# Altium schematic sheet MCU_Control.SchDoc
size A4; SheetNumber: 2; SheetTotal: 7
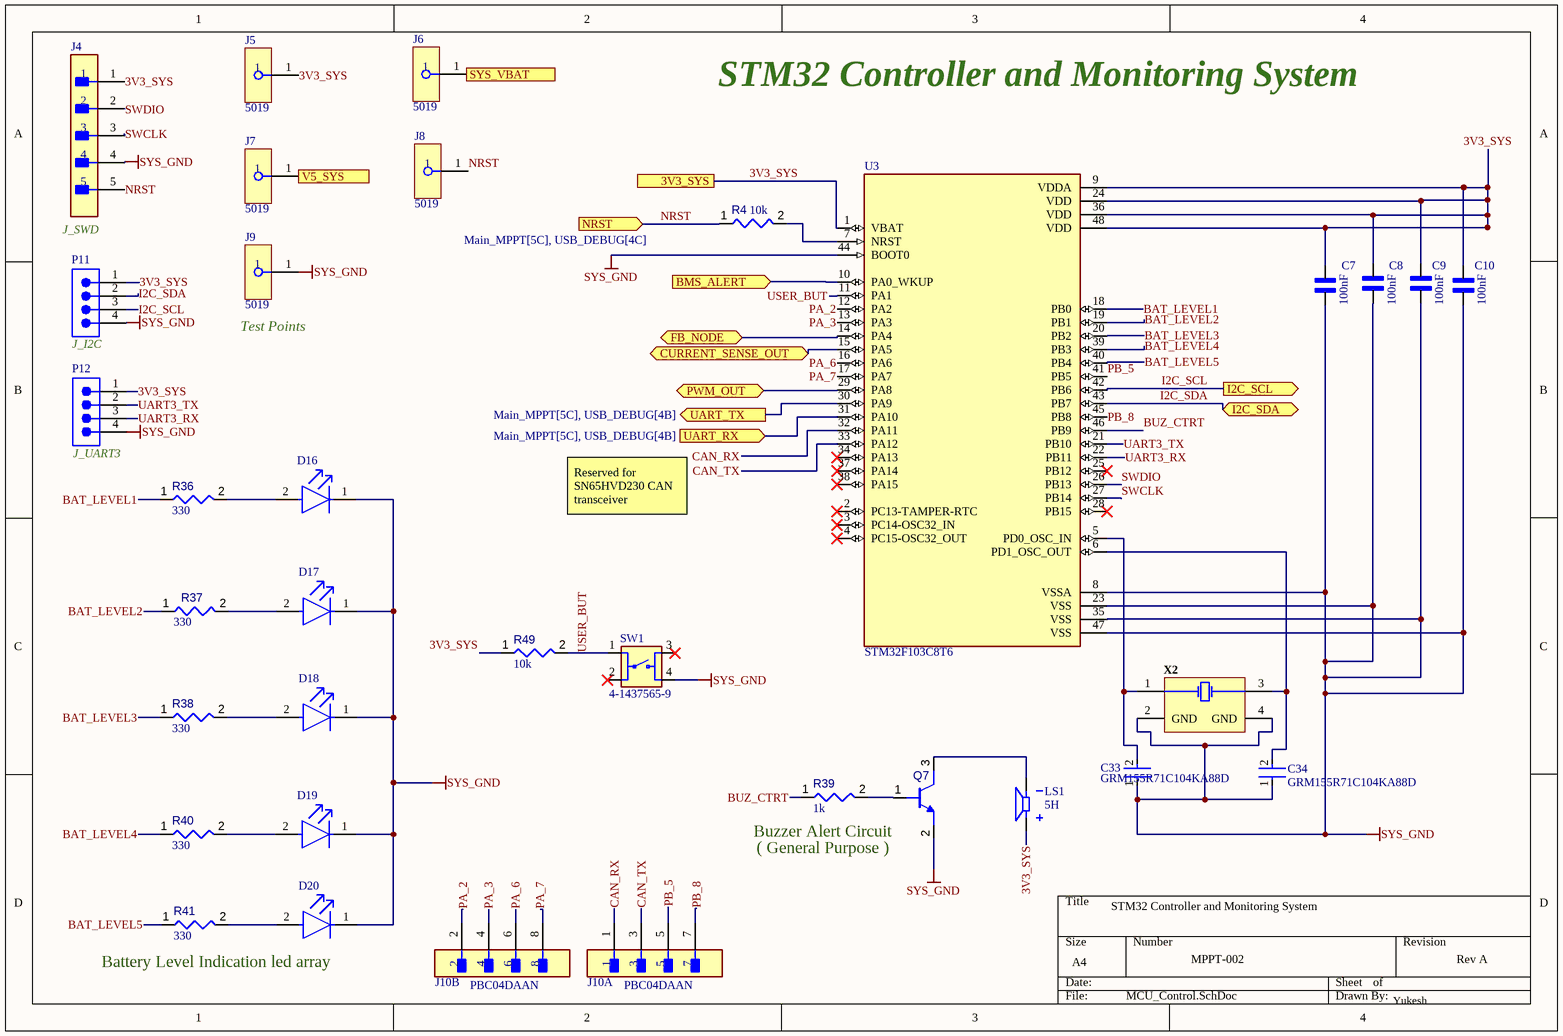
[diagram p0: MCU_Control.SchDoc]

## Parts
C7  value 100nF  [CAPC1608X90N]  (hidden comment: 0603YC104KAZ2A)
C8  value 100nF  [CAPC1608X90N]  (hidden comment: 0603YC104KAZ2A)
C9  value 100nF  [CAPC1608X90N]  (hidden comment: 0603YC104KAZ2A)
C10  value 100nF  [CAPC1608X90N]  (hidden comment: 0603YC104KAZ2A)
C33  GRM155R71C104KA88D  [FP-GRM15-MFG]
C34  GRM155R71C104KA88D  [FP-GRM15-MFG]
D16  SML-LX0805UWC-TR  [FP-SML-LX0805UWC-TR-MFG]  (value not drawn)
D17  SML-LX0805UWC-TR  [FP-SML-LX0805UWC-TR-MFG]  (value not drawn)
D18  SML-LX0805UWC-TR  [FP-SML-LX0805UWC-TR-MFG]  (value not drawn)
D19  SML-LX0805UWC-TR  [FP-SML-LX0805UWC-TR-MFG]  (value not drawn)
D20  SML-LX0805UWC-TR  [FP-SML-LX0805UWC-TR-MFG]  (value not drawn)
J4  22-28-4050  [FP-22-28-4050-MFG]  (value not drawn)
J5  5019  [5019_MFG]
J6  5019  [5019_MFG]
J7  5019  [5019_MFG]
J8  5019  [5019_MFG]
J9  5019  [5019_MFG]
J10  PBC04DAAN  [FP-PBC04DAAN-MFG]  (parts A,B of 2)
LS1  value 5H  [XDCR_CMI-1210-5-95T]  (hidden comment: CMI-1210-5-95T)
P11  TSW-104-08-G-S  [SMTC-TSW-104-08-X-S]  (value not drawn)
P12  TSW-104-08-G-S  [SMTC-TSW-104-08-X-S]  (value not drawn)
Q7  MMBT2222AM3T5G  [ROHM-SOT723-3_V]  (value not drawn)
R4  value 10k  [RESC3216X60X45ML15T20]  (hidden comment: Resistor 10k +/-1% 1206 250 mW)
R36  value 330  [RESC0402(1005)_L]  (hidden comment: 330R2J)
R37  value 330  [RESC0402(1005)_L]  (hidden comment: 330R2J)
R38  value 330  [RESC0402(1005)_L]  (hidden comment: 330R2J)
R39  value 1k  [RESC0805(2012)_L]  (hidden comment: 1KR5J)
R40  value 330  [RESC0402(1005)_L]  (hidden comment: 330R2J)
R41  value 330  [RESC0402(1005)_L]  (hidden comment: 330R2J)
R49  value 10k  [RESC0402(1005)_L]  (hidden comment: 10KR2F)
SW1  4-1437565-9  [TE_4-1437565-9]
U3  STM32F103C8T6  [QFP50P900X900X160-48N]
X2  TSX-3225 24.0000MF15X-AC3  [EPSON-TSX-3225_V]  (value not drawn)

## Ports
3V3_SYS (see Main_MPPT[5B], BMS_CORE[2C], OUTPUT_CONNECTORS[4B], POWER_DISTRIBUTION[4C], POWER_SWITCH[2C], POWER_SWITCH[2D], USB_DEBUG[4B]), BMS_ALERT (in, see Main_MPPT[4C], BMS_CORE[2B]), CURRENT_SENSE_OUT (bidir, see Main_MPPT[4C]), FB_NODE (bidir, see Main_MPPT[4B]), I2C_SCL (out, see Main_MPPT[4C], BMS_CORE[4B]), I2C_SDA (bidir, see Main_MPPT[4C], BMS_CORE[4B]), NRST (in, see Main_MPPT[5C], USB_DEBUG[4C]), PWM_OUT (bidir, see Main_MPPT[4B]), SYS_VBAT (in, see Main_MPPT[5B], POWER_DISTRIBUTION[1A], POWER_SWITCH[1B]), UART_RX (in, see Main_MPPT[5C], USB_DEBUG[4B]), UART_TX (out, see Main_MPPT[5C], USB_DEBUG[4B]), V5_SYS (see Main_MPPT[5C], OUTPUT_CONNECTORS[4C], POWER_DISTRIBUTION[4B])

## Nets
SYS_GND: C7.1 C8.1 C9.1 C10.1 C33.1 C34.1 D16.1(C) D17.1(C) D18.1(C) D19.1(C) D20.1(C) J4.4 J9.1 P11.4 P12.4 Q7.2(E) SW1.4 U3.8(VSSA) U3.23(VSS) U3.35(VSS) U3.44(BOOT0) U3.47(VSS) X2.2(GND) X2.4(GND)
3V3_SYS: C7.2 C8.2 C9.2 C10.2 J4.1 J5.1 LS1.P P11.1 P12.1 R49.1 U3.1(VBAT) U3.9(VDDA) U3.24(VDD) U3.36(VDD) U3.48(VDD) ; port 3V3_SYS
BAT_LEVEL1: R36.1 U3.18(PB0)
BAT_LEVEL2: R37.1 U3.19(PB1)
BAT_LEVEL3: R38.1 U3.20(PB2)
BAT_LEVEL4: R40.1 U3.39(PB3)
BAT_LEVEL5: R41.1 U3.40(PB4)
BMS_ALERT: U3.10(PA0_WKUP) ; port BMS_ALERT
BUZ_CTRT: R39.1 U3.46(PB9)
CAN_RX: J10.1 U3.32(PA11)
CAN_TX: J10.3 U3.33(PA12)
CURRENT_SENSE_OUT: U3.15(PA5) ; port CURRENT_SENSE_OUT
FB_NODE: U3.14(PA4) ; port FB_NODE
I2C_SCL: P11.3 U3.42(PB6) ; port I2C_SCL
I2C_SDA: P11.2 U3.43(PB7) ; port I2C_SDA
NRST: J4.5 J8.1 R4.1 ; port NRST
PA_2: J10.2 U3.12(PA2)
PA_3: J10.4 U3.13(PA3)
PA_6: J10.6 U3.16(PA6)
PA_7: J10.8 U3.17(PA7)
PB_5: J10.5 U3.41(PB5)
PB_8: J10.7 U3.45(PB8)
PWM_OUT: U3.29(PA8) ; port PWM_OUT
SWCLK: J4.3 U3.27(PB14)
SWDIO: J4.2 U3.26(PB13)
SYS_VBAT: J6.1 ; port SYS_VBAT
UART3_RX: P12.3 U3.22(PB11)
UART3_TX: P12.2 U3.21(PB10)
UART_RX: U3.31(PA10) ; port UART_RX
UART_TX: U3.30(PA9) ; port UART_TX
USER_BUT: R49.2 SW1.1 U3.11(PA1)
V5_SYS: J7.1 ; port V5_SYS
NetC33_2: C33.2 U3.5(PD0_OSC_IN) X2.1(X1)
NetC34_2: C34.2 U3.6(PD1_OSC_OUT) X2.3(X2)
NetD16_2: D16.2(A) R36.2
NetD17_2: D17.2(A) R37.2
NetD18_2: D18.2(A) R38.2
NetD19_2: D19.2(A) R40.2
NetD20_2: D20.2(A) R41.2
NetLS1_N: LS1.N Q7.3(C)
NetQ7_1: Q7.1(B) R39.2
NetR4_2: R4.2 U3.7(NRST)

Not connected (* = marked no-connect by the designer): SW1 2* 3*; U3 2(PC13-TAMPER-RTC)* 3(PC14-OSC32_IN)* 4(PC15-OSC32_OUT)* 25(PB12)* 28(PB15)* 34(PA13)* 37(PA14)* 38(PA15)*

## Notes on the sheet
- STM32 Controller and Monitoring System
- J_SWD
- (near P11) J_I2C
- (near J9) Test Points
- (near P12) J_UART3
- Reserved for SN65HVD230 CAN transceiver
- (near Q7) Buzzer Alert Circuit
- (near Q7) ( General Purpose )
- Battery Level Indication led array
- MPPT-002
- Rev A
- Yukesh

## Library data of the parts
C7-C10 = CMP-001-00089-1: Capacitor MLCC 0603 100nF 16V; MF: AVX; MP: 0603YC104KAZ2A; SnapEDA_Link: https://www.snapeda.com/parts/0603YC104KAZ2A/AVX/view-part/?ref=snap; Case/Package: 1608 AVX; Source: 0603YC104KAZ2A.SchLib; Check_prices: https://www.snapeda.com/parts/0603YC104KAZ2A/AVX/view-part/?ref=eda; Pins: 2; Design Item ID: 0603YC104KAZ2A; Component Type: Standard
C33 C34 = CMP-2100-03641-2: CAP CER 0.1UF 16V X7R 0402; Manufacturer: Murata; Standoff Height: 0mm; Tolerance: 10%; Voltage Rating: 16Vdc; Material: Ceramic; Capacitance: 0.10μF; Value: 0.10μF; RoHS: TRUE; Manufacturer Part Number: GRM155R71C104KA88D; Temperature Characteristic: X7R; Octopart: https://octopart.com/grm155r71c104ka88d-murata-196880; Digikey Description: CAP CER 0.1UF 16V X7R 0402; Device Class L3: Ceramic Capacitors; Height: 0.55mm; ComponentLink2Description: Datasheet; Temperature Range Low: -55°C; Ipc Land Pattern Name: CAPC10050X219; ComponentLink2URL: https://search.murata.co.jp/Ceramy/image/img/A01X/G101/ENG/GRM155R71H471KA01-01A.pdf; Device Class L1: Passive Components; Lead Free: yes; Category: Cap; Package: GRM15; Temperature: -55°C to +125°C; Device Class L2: Capacitors; Temperature Range High: +125°C; Mouser Description: 0402 0.1 uF 16V ±10 % Tolerance X7R SMT Multilayer Ceramic Capacitor
D16-D20 = CMP-00229-00139794-1: SML-LX0805UWC-TR White LED, 0805 Diffused, Rectangle Lens SMD package; NexarPartId: 139794; Approvals: CSA, UL; Lens Color: Clear, Yellow; Luminous Intensity: 150mcd; Power Rating: 120mW; Forward Current: 20mA; Forward Voltage: 3.5V; Number of LEDs: 1; Viewing Angle: 120°; RoHS: Compliant; Case/Package: 0805; Illumination Color: White; Min Operating Temperature: -40°C; Mount: Surface Mount; Max Operating Temperature: 85°C
J4 = CMP-00257-00278173-1: 22-28-4050 KK® 254 Breakaway Header, Vertical, 5 Circuits, Tin (Sn) Plating, Mating Pin Length 6.09mm; NexarPartId: 278173; Voltage Rating: 250V; Number of Contacts: 5; Contact Resistance: 20mΩ; Gender: Male; Pitch: 2.54mm; Connector Type: Male Pin; Current Rating: 4A; Glow Wire Compliant: Non-compliant; Max Voltage Rating (DC): 250.25kV; Flammability Rating: UL94 V-0; Min Operating Temperature: 0°C; REACH SVHC: Unknown; Lead Free: Lead Free; Termination: Solder; RoHS: Compliant; Schedule B: 8536694040; Number of Circuits: 5; Mount: Through Hole; Lead Pitch: 2.54mm; Height: 2.29mm; Voltage Rating (DC): 250V; Max Operating Temperature: 75°C; Width: 2.49mm; Radiation Hardening: No; Contact Plating: Tin; Orientation: Vertical; Length: 12.7mm; Number of Rows: 1; Housing Material: Thermoplastic; Contact Material: Brass; Packaging: Bulk; Contact Mating Length: 6.096mm; Housing Color: Black; Color: Black; Number of Positions: 5
J5-J9 = CMP-1672-00008-3: Phosphor Bronze Contact Miniature Silver Plated Surface Mount Test Points; Number of Contacts: 1; ComponentLink1Description: Manufacturer's Website; Number of Pins: 1; Height: 2.42mm; Mount: Surface Mount; HelpURL: https://www.keyelco.com/product-pdf.cfm?p=1357; REACH SVHC: Yes; Packaging: Tape and Reel; Lead Free: Lead Free; ComponentLink1URL: http://www.keyelco.com/; Termination: SMD/SMT; Material: Bronze; Contact Plating: Silver; Contact Material: Silver; RoHS: Compliant; ComponentLink2URL: https://www.keyelco.com/product-pdf.cfm?p=1357; China RoHS: Compliant; Lifecycle Status: Production; ComponentLink2Description: Datasheet URL
J10 = CMP-25680-000082-1: CONN HEADER VERT 8POS 2.54MM; Number of Positions: 8; Pitch: 0.1inch; Gender: Male; Connector Type: Male Pin; Length: 10.2mm; Contact Plating: Gold; Housing Color: Black; RoHS Compliant: Yes; Termination: Solder; Number of Contacts: 8; Mount: Through Hole; Color: Black; Housing Material: Plastic; Number of Rows: 2; Contact Material: Bronze; Lead Free: Lead Free; Contact Type: Male Pin; Height: 2.54mm; Packaging: Bulk; Width: 5.08mm; Package Quantity: 1; Contact Mating Length: 0.23inch; Row Spacing: 0.1inch
LS1 = CMP-006-00030-3: 12 mm, 5 Vdc, 98 dB, Through Hole, Magnetic Audio Indicator Buzzer; MF: Same Sky; Design Item ID: CMI-1210-5-95T; Check_prices: https://www.snapeda.com/parts/CMI-1210-5-95T/Same+Sky/view-part/?ref=eda; SnapEDA_Link: https://www.snapeda.com/parts/CMI-1210-5-95T/Same+Sky/view-part/?ref=snap; Source: CMI-1210-5-95T.SchLib; Pins: 2; Case/Package: None; Component Type: Standard; MP: CMI-1210-5-95T
P11 P12 = CMP-1024-00357-1: 0.025" SQ Post Header, Through-hole, Vertical, -55 to 125 degC, 2.54 mm Pitch, 4-Pin, Male, RoHS; Manufacturer: Samtec; Pitch: 2.54 mm; RoHS: True; ComponentLink3URL: http://www.samtec.com/documents/webfiles/cpdf/TSW-XXX-XX-XXX-X-XX-XXX-MKT.pdf; Mounting Technology: Through-hole; ComponentLink2URL: http://www.samtec.com/documents/webfiles/pdf/TSW_TH.PDF; ComponentLink1URL: http://www.samtec.com; ComponentLink3Description: Package Specification; PackageVersion: DM, 8/1988; ComponentLink2Description: Datasheet; PackageReference: TSW-104-08-X-S; PackageDescription: .025[0.64] SQ. Post Terminal Strip Assembly; PartNumber: TSW-104-08-G-S; ComponentLink1Description: Manufacturer URL; Temperature Range: -55 to 125 degC; DatasheetVersion: F-214; Orientation: Vertical
Q7 = CMP-013-00028-2: NPN General Purpose Transistor, 3-Pin SOT-723, Pb-Free, Tape and Reel; ComponentLink3Description: Package Specification; ComponentLink1URL: http://www.onsemi.com/; ComponentLink3URL: http://www.onsemi.com/pub_link/Collateral/631AA.PDF; ComponentLink2Description: Datasheet; Mounting Technology: SMT; Pins: 3; Case/Package: SOT-723; RoHS Compliant: TRUE; ComponentLink1Description: Manufacturer URL; ComponentLink2URL: http://www.onsemi.cn/pub_link/Collateral/MMBT2222AM3-D.PDF
R4 = CMP-009-00016-5: Chip Resistor, 10 KOhm, +/- 1%, 0.25 W, -55 to 155 degC, 1206 (3216 Metric); Power: 250mW; Voltage Rating: 200V; Pins: 2; Max Operating Temperature: 155°C; Tolerance: 1%; RoHS Compliant: True; Case/Package: 1206; Min Operating Temperature: -55°C; Mounting Technology: SM
R36-R38 R40 R41 = CMP-009-00095-2: 330R 0.063W 5% 0402 (1005 Metric)  SMD; Power: 63mW; Tolerance: 5%; Mounting Technology: SMT; Case/Package: 0402; Pins: 2
R39 = CMP-009-00076-2: 1K 0.125W 5% 0805 (2012 Metric)  SMD; Power: 125mW; Pins: 2; Mounting Technology: SMT; Tolerance: 5%; Case/Package: 0805
R49 = CMP-009-00066-2: 10K 0.063W 1% 0402 (1005 Metric)  SMD; Power: 63mW; Case/Package: 0402; Mounting Technology: SMT; Pins: 2; Tolerance: 1%
SW1 = CMP-011-00013-1: Alcoswitch, Switch, Tactile, 50 mA, SPST, Pushbutton, Off[On], FSM6JSMA; MF: TE Connectivity; Contact_Current_Rating: 50 mA; Configuration_Pole-Throw: Single Pole - Single Throw; EU_RoHS_Compliance: Compliant; Design Item ID: 4-1437565-9; SnapEDA_Link: https://www.snapeda.com/parts/FSM6JSMA/TE+Connectivity+ALCOSWITCH+Switches/view-part/?ref=snap; Value: *; Check_prices: https://www.snapeda.com/parts/FSM6JSMA/TE+Connectivity+ALCOSWITCH+Switches/view-part/?ref=eda; MP: FSM6JSMA; Source: 4-1437565-9.SchLib; Case/Package: None
U3 = CMP-031-06208-1: ARM® Cortex®-M3 STM32F1 Microcontroller IC 32-Bit 72MHz 64KB (64K x 8) FLASH 48-LQFP (7x7); MF: STMicroelectronics; Check_prices: https://www.snapeda.com/parts/STM32F103C8T6/STMicroelectronics/view-part/?ref=eda; Pins: 48; MP: STM32F103C8T6; Value: IC; Case/Package: LQFP-48 STMicroelectronics; Component Type: Standard; SnapEDA_Link: https://www.snapeda.com/parts/STM32F103C8T6/STMicroelectronics/view-part/?ref=snap; Design Item ID: STM32F103C8T6; Source: STM32F103C8T6.SchLib
X2 = CMP-2000-07333-1: MHz Range Crystal, 24 MHz, -40 to 85 degC, 4-Pin SMD, RoHS, Tape and Reel; Manufacturer: Epson; Brand: EpsonTiming; Frequency Stability: 10PPM; Frequency: 24MHz; ESR: 40Ohms; Load Capacitance: 9pF; Unit Weight: 0.000564oz; Drive Level: 200uW; Datasheet Version: 12/2015; RoHS: True; Operating Temperature Range: -40Cto+85C; Length: 3.2mm; Tolerance: 10PPM; Width: 2.5mm; Mounting Technology: SurfaceMount; Package Description: 4-Pin Surface Mount Device, Body 3.2 x 2.5 mm; Manufacturer URL: https://www.eea.epson.com/; Factory Pack Quantity: 250; Package Reference: TSX-3225; Height: 0.6mm; Mounting Style: SMD/SMT; Termination Style: SMD/SMT; Datasheet URL: https://support.epson.biz/td/api/doc_check.php?dl=brief_FA-238V_en.pdf; Type: Crystal; Series: TSX-3225; Package / Case: 3.2mmx2.5mm; Product Category: Crystals; Packaging: Reel